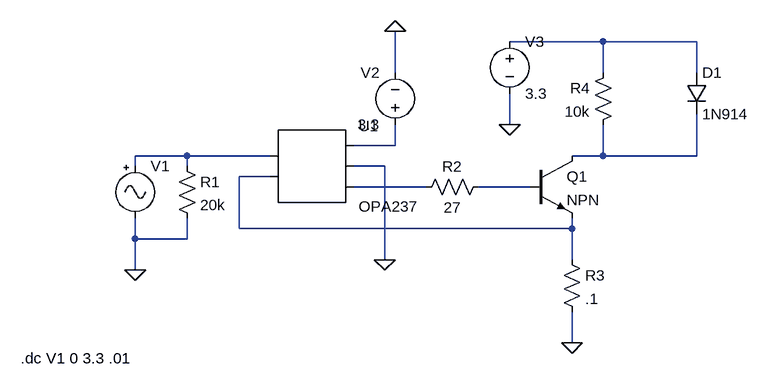
[diagram p0: schematic LaserDiode Driver.asc]
LaserDiode Driver.asc, the LTspice schematic file:
Version 4
SHEET 1 1828 680
WIRE 672 -48 528 -48
WIRE 816 -48 672 -48
WIRE 352 0 352 -64
WIRE 672 0 672 -48
WIRE 816 0 816 -48
WIRE 528 80 528 32
WIRE 352 112 352 80
WIRE 352 112 288 112
WIRE 32 128 -48 128
WIRE 160 128 32 128
WIRE 672 128 672 80
WIRE 672 128 624 128
WIRE 816 128 816 64
WIRE 816 128 672 128
WIRE -48 144 -48 128
WIRE 32 144 32 128
WIRE 336 144 288 144
WIRE 160 160 112 160
WIRE 400 176 288 176
WIRE 560 176 480 176
WIRE 112 240 112 160
WIRE 624 240 624 224
WIRE 624 240 112 240
WIRE -48 256 -48 224
WIRE 32 256 32 224
WIRE 32 256 -48 256
WIRE 336 288 336 144
WIRE 624 288 624 240
WIRE -48 304 -48 256
WIRE 624 416 624 368
FLAG 336 288 0
FLAG 352 -64 0
FLAG 624 416 0
FLAG -48 304 0
FLAG 528 80 0
SYMBOL Misc\\signal -48 128 R0
WINDOW 3 304 104 Invisible 2
WINDOW 123 0 0 Left 0
WINDOW 39 0 0 Left 0
SYMATTR Value SINE(1.5 1.5 10)
SYMATTR InstName V1
SYMBOL AutoGenerated\\OPA237 224 144 R0
SYMATTR InstName U1
SYMBOL voltage 352 96 R180
WINDOW 0 24 96 Left 2
WINDOW 3 24 16 Left 2
WINDOW 123 0 0 Left 0
WINDOW 39 0 0 Left 0
SYMATTR InstName V2
SYMATTR Value 3.3
SYMBOL res 16 128 R0
SYMATTR InstName R1
SYMATTR Value 20k
SYMBOL res 496 160 R90
WINDOW 0 0 56 VBottom 2
WINDOW 3 32 56 VTop 2
SYMATTR InstName R2
SYMATTR Value 27
SYMBOL npn 560 128 R0
SYMATTR InstName Q1
SYMBOL res 608 272 R0
SYMATTR InstName R3
SYMATTR Value .1
SYMBOL voltage 528 -64 R0
WINDOW 123 0 0 Left 0
WINDOW 39 0 0 Left 0
SYMATTR InstName V3
SYMATTR Value 3.3
SYMBOL res 688 -16 M0
SYMATTR InstName R4
SYMATTR Value 10k
SYMBOL diode 800 0 R0
SYMATTR InstName D1
SYMATTR Value 1N914
TEXT -224 440 Left 2 !.dc V1 0 3.3 .01

The netlist it stands for:
* LaserDiode Driver.asc
V1 N003 0 SINE(1.5 1.5 10)
* U1: OPA237 (symbol AutoGenerated\OPA237 not available, pins judged from their places): pin1=N003 pin2=N005 pin3=N002 pin4=0 pin5=N006
V2 N002 0 3.3
R1 N003 0 20k
R2 N007 N006 27
Q1 N004 N007 N005 0 NPN
R3 N005 0 .1
V3 N001 0 3.3
R4 N001 N004 10k
D1 N001 N004 1N914
.model D D
.lib standard.dio
.model NPN NPN
.model PNP PNP
.lib standard.bjt
.dc V1 0 3.3 .01
.backanno
.end